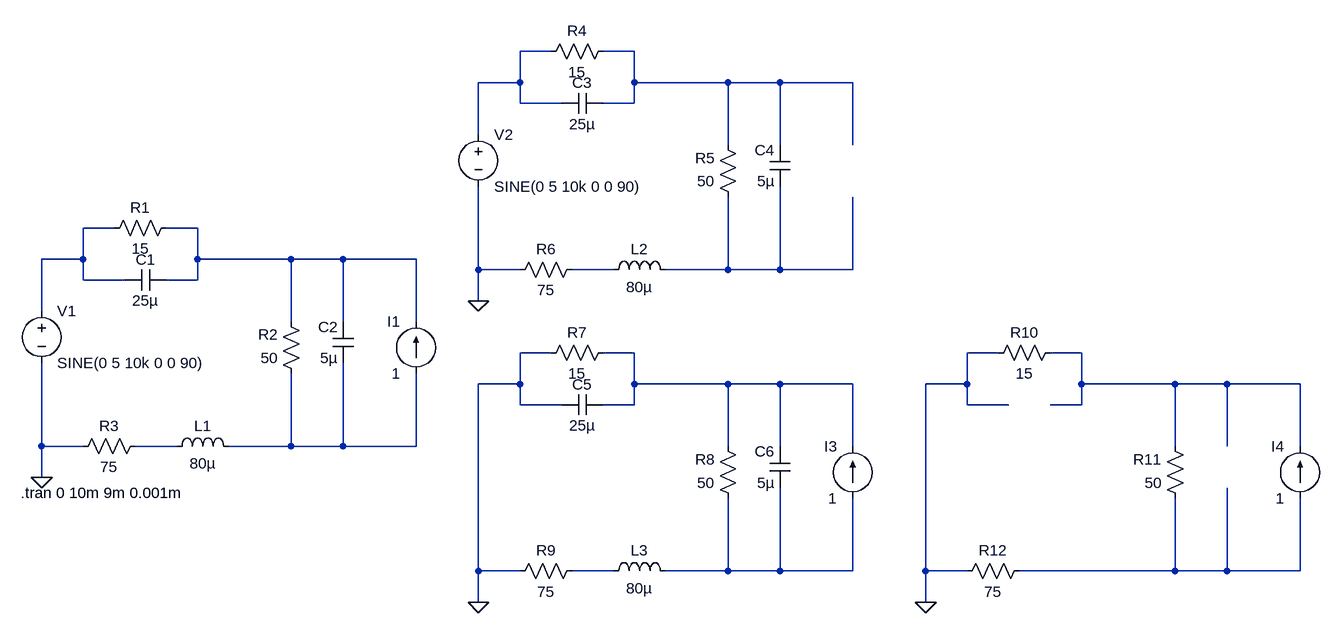
[diagram p0: schematic RTR806_Class_14_20231102_Investigation_of_superposition.asc]
RTR806_Class_14_20231102_Investigation_of_superposition.asc, the LTspice schematic file:
Version 4
SHEET 1 2148 680
WIRE 784 -304 736 -304
WIRE 912 -304 864 -304
WIRE 736 -256 736 -304
WIRE 736 -256 672 -256
WIRE 912 -256 912 -304
WIRE 1056 -256 912 -256
WIRE 1136 -256 1056 -256
WIRE 1248 -256 1136 -256
WIRE 736 -224 736 -256
WIRE 800 -224 736 -224
WIRE 912 -224 912 -256
WIRE 912 -224 864 -224
WIRE 672 -176 672 -256
WIRE 1056 -160 1056 -256
WIRE 1136 -160 1136 -256
WIRE 1248 -160 1248 -256
WIRE 112 -32 64 -32
WIRE 240 -32 192 -32
WIRE 64 16 64 -32
WIRE 64 16 0 16
WIRE 240 16 240 -32
WIRE 384 16 240 16
WIRE 464 16 384 16
WIRE 576 16 464 16
WIRE 672 32 672 -96
WIRE 736 32 672 32
WIRE 880 32 816 32
WIRE 1056 32 1056 -80
WIRE 1056 32 960 32
WIRE 1136 32 1136 -96
WIRE 1136 32 1056 32
WIRE 1248 32 1248 -80
WIRE 1248 32 1136 32
WIRE 64 48 64 16
WIRE 128 48 64 48
WIRE 240 48 240 16
WIRE 240 48 192 48
WIRE 672 80 672 32
WIRE 0 96 0 16
WIRE 384 112 384 16
WIRE 464 112 464 16
WIRE 576 112 576 16
WIRE 784 160 736 160
WIRE 912 160 864 160
WIRE 1472 160 1424 160
WIRE 1600 160 1552 160
WIRE 736 208 736 160
WIRE 736 208 672 208
WIRE 912 208 912 160
WIRE 1056 208 912 208
WIRE 1136 208 1056 208
WIRE 1248 208 1136 208
WIRE 1424 208 1424 160
WIRE 1424 208 1360 208
WIRE 1600 208 1600 160
WIRE 1744 208 1600 208
WIRE 1824 208 1744 208
WIRE 1936 208 1824 208
WIRE 736 240 736 208
WIRE 800 240 736 240
WIRE 912 240 912 208
WIRE 912 240 864 240
WIRE 1424 240 1424 208
WIRE 1488 240 1424 240
WIRE 1600 240 1600 208
WIRE 1600 240 1552 240
WIRE 0 304 0 176
WIRE 64 304 0 304
WIRE 208 304 144 304
WIRE 384 304 384 192
WIRE 384 304 288 304
WIRE 464 304 464 176
WIRE 464 304 384 304
WIRE 576 304 576 192
WIRE 576 304 464 304
WIRE 1056 304 1056 208
WIRE 1136 304 1136 208
WIRE 1248 304 1248 208
WIRE 1744 304 1744 208
WIRE 1824 304 1824 208
WIRE 1936 304 1936 208
WIRE 0 352 0 304
WIRE 672 496 672 208
WIRE 736 496 672 496
WIRE 880 496 816 496
WIRE 1056 496 1056 384
WIRE 1056 496 960 496
WIRE 1136 496 1136 368
WIRE 1136 496 1056 496
WIRE 1248 496 1248 384
WIRE 1248 496 1136 496
WIRE 1360 496 1360 208
WIRE 1424 496 1360 496
WIRE 1744 496 1744 384
WIRE 1744 496 1504 496
WIRE 1824 496 1824 368
WIRE 1824 496 1744 496
WIRE 1936 496 1936 384
WIRE 1936 496 1824 496
WIRE 672 544 672 496
WIRE 1360 544 1360 496
FLAG 0 352 0
FLAG 672 80 0
FLAG 672 544 0
FLAG 1360 544 0
SYMBOL voltage 0 80 R0
WINDOW 123 0 0 Left 0
WINDOW 39 0 0 Left 0
SYMATTR InstName V1
SYMATTR Value SINE(0 5 10k 0 0 90)
SYMBOL res 208 -48 R90
WINDOW 0 0 56 VBottom 2
WINDOW 3 32 56 VTop 2
SYMATTR InstName R1
SYMATTR Value 15
SYMBOL res 400 208 R180
WINDOW 0 36 76 Left 2
WINDOW 3 36 40 Left 2
SYMATTR InstName R2
SYMATTR Value 50
SYMBOL res 48 320 R270
WINDOW 0 32 56 VTop 2
WINDOW 3 0 56 VBottom 2
SYMATTR InstName R3
SYMATTR Value 75
SYMBOL ind 192 320 R270
WINDOW 0 32 56 VTop 2
WINDOW 3 5 56 VBottom 2
SYMATTR InstName L1
SYMATTR Value 80µ
SYMBOL cap 192 32 R90
WINDOW 0 0 32 VBottom 2
WINDOW 3 32 32 VTop 2
SYMATTR InstName C1
SYMATTR Value 25µ
SYMBOL cap 480 176 R180
WINDOW 0 24 56 Left 2
WINDOW 3 24 8 Left 2
SYMATTR InstName C2
SYMATTR Value 5µ
SYMBOL current 576 192 R180
WINDOW 0 24 80 Left 2
WINDOW 3 24 0 Left 2
SYMATTR InstName I1
SYMATTR Value 1
SYMBOL voltage 672 -192 R0
WINDOW 123 0 0 Left 0
WINDOW 39 0 0 Left 0
SYMATTR InstName V2
SYMATTR Value SINE(0 5 10k 0 0 90)
SYMBOL res 880 -320 R90
WINDOW 0 0 56 VBottom 2
WINDOW 3 32 56 VTop 2
SYMATTR InstName R4
SYMATTR Value 15
SYMBOL res 1072 -64 R180
WINDOW 0 36 76 Left 2
WINDOW 3 36 40 Left 2
SYMATTR InstName R5
SYMATTR Value 50
SYMBOL res 720 48 R270
WINDOW 0 32 56 VTop 2
WINDOW 3 0 56 VBottom 2
SYMATTR InstName R6
SYMATTR Value 75
SYMBOL ind 864 48 R270
WINDOW 0 32 56 VTop 2
WINDOW 3 5 56 VBottom 2
SYMATTR InstName L2
SYMATTR Value 80µ
SYMBOL cap 864 -240 R90
WINDOW 0 0 32 VBottom 2
WINDOW 3 32 32 VTop 2
SYMATTR InstName C3
SYMATTR Value 25µ
SYMBOL cap 1152 -96 R180
WINDOW 0 24 56 Left 2
WINDOW 3 24 8 Left 2
SYMATTR InstName C4
SYMATTR Value 5µ
SYMBOL res 880 144 R90
WINDOW 0 0 56 VBottom 2
WINDOW 3 32 56 VTop 2
SYMATTR InstName R7
SYMATTR Value 15
SYMBOL res 1072 400 R180
WINDOW 0 36 76 Left 2
WINDOW 3 36 40 Left 2
SYMATTR InstName R8
SYMATTR Value 50
SYMBOL res 720 512 R270
WINDOW 0 32 56 VTop 2
WINDOW 3 0 56 VBottom 2
SYMATTR InstName R9
SYMATTR Value 75
SYMBOL ind 864 512 R270
WINDOW 0 32 56 VTop 2
WINDOW 3 5 56 VBottom 2
SYMATTR InstName L3
SYMATTR Value 80µ
SYMBOL cap 864 224 R90
WINDOW 0 0 32 VBottom 2
WINDOW 3 32 32 VTop 2
SYMATTR InstName C5
SYMATTR Value 25µ
SYMBOL cap 1152 368 R180
WINDOW 0 24 56 Left 2
WINDOW 3 24 8 Left 2
SYMATTR InstName C6
SYMATTR Value 5µ
SYMBOL current 1248 384 R180
WINDOW 0 24 80 Left 2
WINDOW 3 24 0 Left 2
SYMATTR InstName I3
SYMATTR Value 1
SYMBOL res 1568 144 R90
WINDOW 0 0 56 VBottom 2
WINDOW 3 32 56 VTop 2
SYMATTR InstName R10
SYMATTR Value 15
SYMBOL res 1760 400 R180
WINDOW 0 36 76 Left 2
WINDOW 3 36 40 Left 2
SYMATTR InstName R11
SYMATTR Value 50
SYMBOL res 1408 512 R270
WINDOW 0 32 56 VTop 2
WINDOW 3 0 56 VBottom 2
SYMATTR InstName R12
SYMATTR Value 75
SYMBOL current 1936 384 R180
WINDOW 0 24 80 Left 2
WINDOW 3 24 0 Left 2
SYMATTR InstName I4
SYMATTR Value 1
TEXT -32 376 Left 2 !.tran 0 10m 9m 0.001m

The netlist it stands for:
* RTR806_Class_14_20231102_Investigation_of_superposition.asc
V1 N003 0 SINE(0 5 10k 0 0 90)
R1 N004 N003 15
R2 N010 N004 50
R3 0 N009 75
L1 N009 N010 80µ
C1 N004 N003 25µ
C2 N010 N004 5µ
I1 N010 N004 1
V2 N001 0 SINE(0 5 10k 0 0 90)
R4 N002 N001 15
R5 N006 N002 50
R6 0 N005 75
L2 N005 N006 80µ
C3 N002 N001 25µ
C4 N006 N002 5µ
R7 N007 0 15
R8 N012 N007 50
R9 0 N011 75
L3 N011 N012 80µ
C5 N007 0 25µ
C6 N012 N007 5µ
I3 N012 N007 1
R10 N008 0 15
R11 N013 N008 50
R12 0 N013 75
I4 N013 N008 1
.tran 0 10m 9m 0.001m
.backanno
.end